# Altium schematic sheet Power_Regulation.SchDoc
size A; SheetNumber: 2; SheetTotal: 11
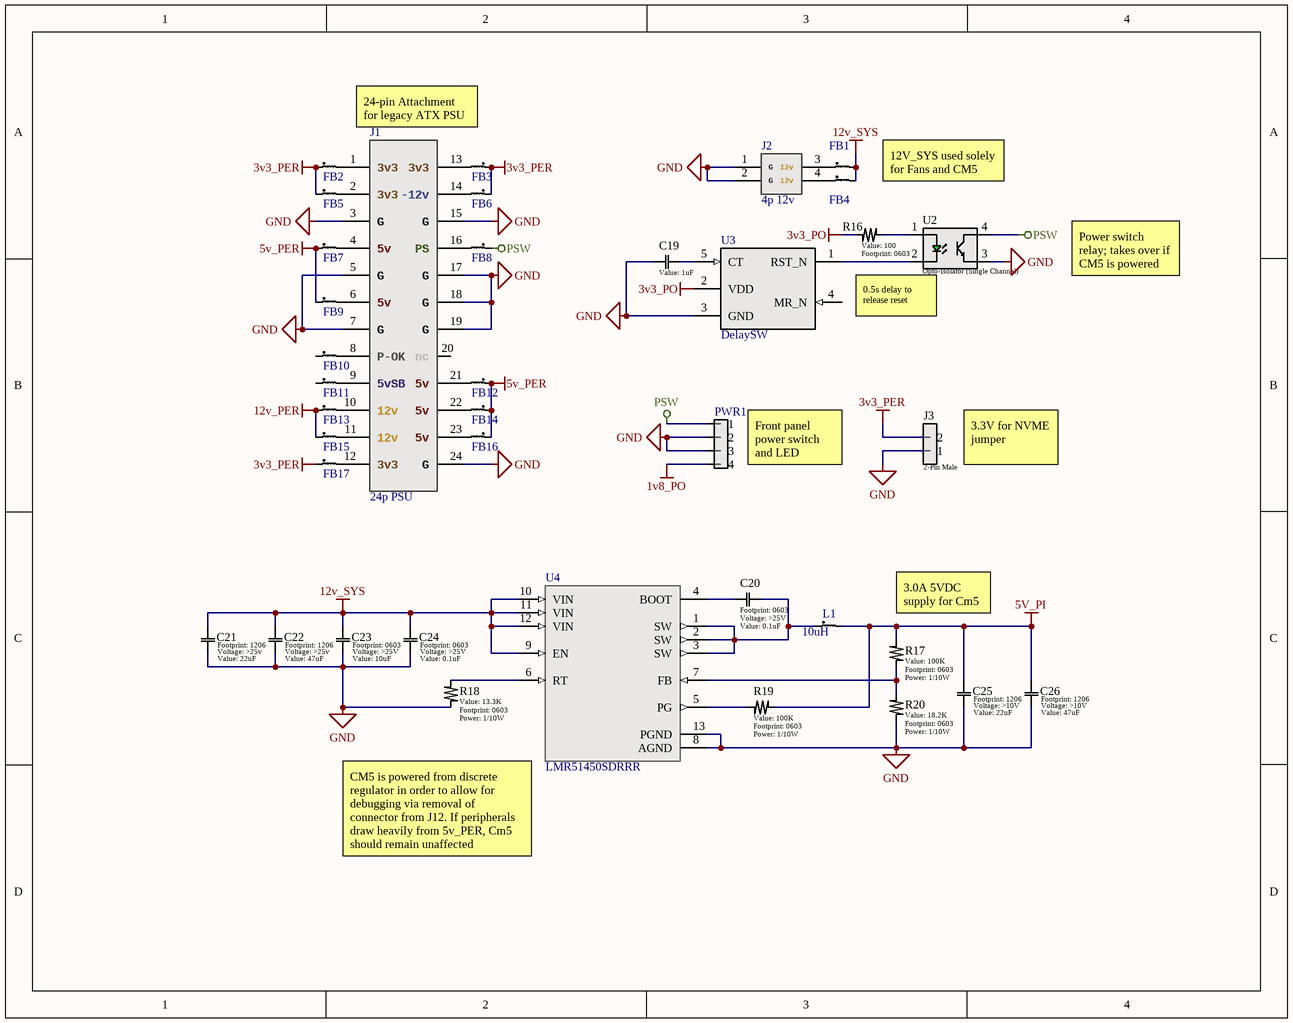
[diagram p0: Power_Regulation.SchDoc]

## Parts
C19  value 1uF  [0603]  (hidden comment: Generic Capacitor)
C20  value 0.1uF  Voltage: >25V  [0603]  (hidden comment: Generic Capacitor)
C21  value 22uF  Voltage: >25v  [1206]  (hidden comment: Generic Capacitor)
C22  value 47uF  Voltage: >25v  [1206]  (hidden comment: Generic Capacitor)
C23  value 10uF  Voltage: >25V  [0603]  (hidden comment: Generic Capacitor)
C24  value 0.1uF  Voltage: >25V  [0603]  (hidden comment: Generic Capacitor)
C25  value 22uF  Voltage: >10V  [1206]  (hidden comment: Generic Capacitor)
C26  value 47uF  Voltage: >10V  [1206]  (hidden comment: Generic Capacitor)
FB1  1206 Ferrite  [1206]  (value not drawn)
FB2  1206 Ferrite  [1206]  (value not drawn)
FB3  1206 Ferrite  [1206]  (value not drawn)
FB4  1206 Ferrite  [1206]  (value not drawn)
FB5  1206 Ferrite  [1206]  (value not drawn)
FB6  1206 Ferrite  [1206]  (value not drawn)
FB7  1206 Ferrite  [1206]  (value not drawn)
FB8  1206 Ferrite  [1206]  (value not drawn)
FB9  1206 Ferrite  [1206]  (value not drawn)
FB10  1206 Ferrite  [1206]  (value not drawn)
FB11  1206 Ferrite  [1206]  (value not drawn)
FB12  1206 Ferrite  [1206]  (value not drawn)
FB13  1206 Ferrite  [1206]  (value not drawn)
FB14  1206 Ferrite  [1206]  (value not drawn)
FB15  1206 Ferrite  [1206]  (value not drawn)
FB16  1206 Ferrite  [1206]  (value not drawn)
FB17  1206 Ferrite  [1206]  (value not drawn)
J1  24p PSU  [CONN_442060007_MOL]
J2  4p 12v  [CON_39281043]
J3  2-Pin Male  [0022057025]
L1  10uH  [SMD 8.2x8.6mm]
PWR1  4-Pin Male Header (0.100" Pitch)  [TSW-104-07-T-S]  (value not drawn)
R16  value 100  [0603]  (hidden comment: Generic Resistor)
R17  value 100K  Power: 1/10W  [0603]  (hidden comment: Generic Resistor)
R18  value 13.3K  Power: 1/10W  [0603]  (hidden comment: Generic Resistor)
R19  value 100K  Power: 1/10W  [0603]  (hidden comment: Generic Resistor)
R20  value 18.2K  Power: 1/10W  [0603]  (hidden comment: Generic Resistor)
U2  Opto-Isolator (Single Channel)  [4-SMD (7.62mm Gull-Wing) Opto-Transistor]
U3  DelaySW  [TSOT-23-5]
U4  LMR51450SDRRR  [WSON-12]

## Nets
1v8_PO: PWR1.4
3v3_PER: FB2.1 FB3.1 FB5.1 FB6.1 FB17.1 J3.2
3v3_PO: R16.1 U3.2(VDD)
5v_PER: FB7.1 FB9.1 FB12.1 FB14.1 FB16.1
5V_PI: C25.1 C26.1 L1.2 R17.2 R19.1
12v_PER: FB13.1 FB15.1
12v_SYS: C21.1 C22.1 C23.1 C24.1 FB1.2 FB4.2 U4.9(EN) U4.10(VIN) U4.11(VIN) U4.12(VIN)
GND: C19.2 C21.2 C22.2 C23.2 C24.2 C25.2 C26.2 J1.3(G) J1.5(G) J1.7(G) J1.15(G) J1.17(G) J1.18(G) J1.19(G) J1.24(G) J2.1(G) J2.2(G) J3.1 PWR1.2 PWR1.3 R18.1 R20.1 U2.3 U3.3(GND) U4.8(AGND) U4.13(PGND)
PSW: FB8.1 PWR1.1 U2.4
NetC19_1: C19.1 U3.5(CT)
NetC20_1: C20.1 U4.4(BOOT)
NetC20_2: C20.2 L1.1 U4.1(SW) U4.2(SW) U4.3(SW)
NetFB1_1: FB1.1 J2.3(12v)
NetFB2_2: FB2.2 J1.1(3v3)
NetFB3_2: FB3.2 J1.13(3v3)
NetFB4_1: FB4.1 J2.4(12v)
NetFB5_2: FB5.2 J1.2(3v3)
NetFB6_2: FB6.2 J1.14(-12v)
NetFB7_2: FB7.2 J1.4(5v)
NetFB8_2: FB8.2 J1.16(PS)
NetFB9_2: FB9.2 J1.6(5v)
NetFB10_2: FB10.2 J1.8(P-OK)
NetFB11_2: FB11.2 J1.9(5vSB)
NetFB12_2: FB12.2 J1.21(5v)
NetFB13_2: FB13.2 J1.10(12v)
NetFB14_2: FB14.2 J1.22(5v)
NetFB15_2: FB15.2 J1.11(12v)
NetFB16_2: FB16.2 J1.23(5v)
NetFB17_2: FB17.2 J1.12(3v3)
NetR16_2: R16.2 U2.1
NetR17_1: R17.1 R20.2 U4.7(FB)
NetR18_2: R18.2 U4.6(RT)
NetR19_2: R19.2 U4.5(PG)
NetU2_2: U2.2 U3.1(RST_N)

Not connected (* = marked no-connect by the designer): FB10 1; FB11 1; J1 20(nc); U3 4(MR_N)

## Notes on the sheet
- 24-pin Attachment for legacy ATX PSU
- 12V_SYS used solely for Fans and CM5
- Power switch relay; takes over if CM5 is powered
- (near U2) 0.5s delay to release reset
- (near PWR1) Front panel power switch and LED
- (near J3) 3.3V for NVME jumper
- (near R17) 3.0A 5VDC supply for Cm5
- (near U4) CM5 is powered from discrete regulator in order to allow for debugging via removal of connector from J12. If peripherals draw heavily from 5v_PER, Cm5 should remain unaffected
- REV
- REVISIONS
- DATE
- DESCRIPTION
- BY
- UNLESS OTHERWISE SPECIFIED, DRAWING DEFINITIONS AND TOLERANCES SHALL BE FOUND UNDER SUPPLIER STANDARDS SS-001. THIS PART AND ALL COMPONENTS OF IT MUST BE RoHS & REACH COMPLIANT. A CERTIFICATE OF COMPLIANCE MUST BE PROVIDED UPON REQUEST.
- ALL INFORMATION ON THIS DOCUMENT IS THE SOLE PROPERTY OF GAMBER-JOHNSON AND SHALL NOT BE COPIED, REPRODUCED, USED OR DISCLOSED IN WHOLE OR IN PART WITHOUT THE WRITTEN CONSENT OF GAMBER-JOHNSON
- TOLERANCES
  .00 ± .060
  .000 ± .020
  .0000 ± .005
  ANGELS ± 1°
- DRAWN BY:
- PROJECT NUMBER:
- SHEET TITLE:
- SHEET
- OF
- DATE:
- LOCATION:
- ASSEMBLY NUMBER
- SIZE
- GAMBER-JOHNSON LLC
  5001 JOERNS DR.
  STEVENS POINT, WI 54481
  +1 (715) 344-5209
- B

## Library data of the parts
C19 = Generic Capacitor: Voltage: 10V; Tolerance: 10%
C20 C23 C24 C26 = Generic Capacitor: Tolerance: 10%
C21 C22 C25 = Generic Capacitor: Tolerance: 20%
FB1-FB17 = HI1206T161R-10: 160 Ohms @ 100MHz 1 Power, Signal Line Ferrite Bead 1206 (3216 Metric) 6A 18mOhm; Manufacturer 1: Laird Steward; DC Resistance (DCR): 18mR; Number of Lines: 1; Impedance: 160R; Supplier 1: Digi-Key; Manufacturer Part Number 1: HI1206T161R-10; RoHS: Yes; Category: Fixed Inductors; Stock 1: 250713; Pricing 1: 1=0.20000, 10=0.15600, 25=0.12920, 50=0.11140, 100=0.10020, 250=0.08464, 500=0.07572, 1000=0.06458 (USD); Mount: Surface Mount; Case/Package: 1206; Weight: 0.0136oz; Case Code (Metric): 3216; Case Code (Imperial): 1206; Core Material: Ferrite; Material: Ferrite; Min Operating Temperature: -40°C; Max Operating Temperature: 125°C; Package Quantity: 1; Packaging: Tape and Reel; Max Current Rating: 6A; Current Rating: 6A; Max DC Current: 6A; Termination: SMD/SMT; Frequency: 100MHz; Test Frequency: 100MHz; Length: 3.2mm; Height: 0.071inch; Width: 0.063inch; Depth: 1.8mm; Lead Free: Lead Free; REACH SVHC: Unknown; ComponentLink1URL: https://datasheet.ciiva.com/22622/1685743-22622771.pdf?src-supplier=Element14; ComponentLink1Description: https://datasheet.ciiva.com/22622/1685743-22622771.pdf?src-supplier=Element14; ComponentLink2URL: https://datasheet.ciiva.com/16714/70065439-16714326.pdf?src-supplier=Allied+Electronics; ComponentLink2Description: https://datasheet.ciiva.com/16714/70065439-16714326.pdf?src-supplier=Allied+Electronics; Supplier Part Number 1: 240-2411-1-ND; LCSC PN: C2926396
J1 = 442060007: Connector Header Through Hole 24 position 0.165" (4.20mm); Mfr_Name: Molex Connector Corporation; RefDes: RefDes; Type: Type; Supplier 1: Mouser; Supplier Part Number 1: 538-44206-0007; LCSC PN: C7541562
J2 = 39281043: Connector Header Through Hole 4 position 0.165" (4.20mm); Mfr_Name: Molex Connector Corporation; RefDes: RefDes; Type: Type; Supplier 1: Avnet; Supplier Part Number 1: 0039281043; LCSC PN: C2845777
J3 = 0022057025: Conn Shrouded Header (4 Sides) HDR 2 POS 2.5mm Solder RA Thru-Hole SPOX™ Bag; Manufacturer 1: Molex; Number of Poles: 2; Voltage Rating: 250V; Contact Resistance: 20mR; Max Voltage Rating (DC): 250.25kV; Max Voltage Rating (AC): 125V; Current Rating: 3A; Insulation Resistance: 1GR; Connector Type: Male Pin; Shrouded: Yes (With); Test Voltage: 1kV; Glow Wire Compliant: Non-compliant; Supplier 1: RSComponents; Manufacturer Part Number 1: 22-05-7025; RoHS: Yes; Category: Headers and Wire Housings; Stock 1: 1440; Pricing 1: 10=0.40100, 250=0.36000, 1000=0.24900, 5000=0.22200, 10000=0.20700 (USD); Mount: Through Hole,Surface Mount; Contact Plating: Tin,Copper; Contact Material: Brass,Bronze; Housing Color: Natural; Housing Material: Nylon; Color: Natural; Material: Nylon,Polyamide; Insulation Material: Nylon; Min Operating Temperature: -40°C; Max Operating Temperature: 105°C; Packaging: Bulk; Gender: Male; Number of Rows: 1; Termination: Solder; Number of Contacts: 2; Orientation: Right Angle; Package Quantity: 1; Voltage Rating (AC): 250V; Number of Positions: 2; Working Voltage: 250V; Voltage Rating (DC): 250V; Number of Circuits: 2; Contact Gender: Male; Series: SPOX™ 5268; Contact Type: Male Pin; Length: 7.65mm; Height: 5.7mm; Pitch: 2.5mm; Depth: 5.1mm; Lead Pitch: 2.5mm; Contact Mating Length: 0.138inch; Radiation Hardening: No; RoHS Compliant: Yes; REACH SVHC: Unknown; Lead Free: Lead Free; Flammability Rating: UL94 V-0; ComponentLink1URL: https://datasheet.ciiva.com/711/022057025-sd-711958.pdf?src-supplier=Digi-Key; ComponentLink1Description: https://datasheet.ciiva.com/711/022057025-sd-711958.pdf?src-supplier=Digi-Key; ComponentLink2URL: https://datasheet.ciiva.com/25265/1766960-25265813.pdf?src-supplier=Newark; ComponentLink2Description: https://datasheet.ciiva.com/25265/1766960-25265813.pdf?src-supplier=Newark; ComponentLink3URL: https://datasheet.ciiva.com/5155/0022057025-pcb-headers-158480-5155683.pdf?src-supplier=Mouser; ComponentLink3Description: https://datasheet.ciiva.com/5155/0022057025-pcb-headers-158480-5155683.pdf?src-supplier=Mouser; ComponentLink4URL: https://datasheet.ciiva.com/19461/2017869-19461071.pdf?src-supplier=Jameco; ComponentLink4Description: https://datasheet.ciiva.com/19461/2017869-19461071.pdf?src-supplier=Jameco; ComponentLink5URL: https://datasheet.ciiva.com/11747/0900766b80da772b-11747276.pdf?src-supplier=RSComponents; ComponentLink5Description: https://datasheet.ciiva.com/11747/0900766b80da772b-11747276.pdf?src-supplier=RSComponents; ComponentLink6URL: https://datasheet.ciiva.com/7920/1877911-7920684.pdf?src-supplier=Element14; ComponentLink6Description: https://datasheet.ciiva.com/7920/1877911-7920684.pdf?src-supplier=Element14; ComponentLink7URL: https://datasheet.ciiva.com/9468/0022057025-pcb-headers-9468379.pdf?src-supplier=Avnet; ComponentLink7Description: https://datasheet.ciiva.com/9468/0022057025-pcb-headers-9468379.pdf?src-supplier=Avnet; Supplier Part Number 1: 6878086; LCSC PN: C918490
L1 = IHLP3232DZER100M5A: 5.1A 10uH ±20% 5.2A - Power Inductor; Mfr_Name: Vishay; Type: DEV; Copyright: Copyright (C) 2023 Ultra Librarian. All rights reserved.; Manufacturer_Part_Number: IHLP3232DZER100M5A; RefDes: RefDes; LCSC PN: C2051768; Supplier 1: Mouser
PWR1 = TSW-104-07-T-S: Connector Header Through Hole 4 position 0.100" (2.54mm); Manufacturer 1: Samtec; Manufacturer Part Number 1: MTSW-104-07-T-S-170; Number of Contacts: 4; Supplier 1: Avnet; RoHS: Yes; Category: Connectors; Mount: Through Hole; Contact Plating: Tin; Contact Material: Bronze; Min Operating Temperature: -55°C; Max Operating Temperature: 105°C; Number of Rows: 1; Termination: Solder; Gender: Male; Packaging: Bulk; Orientation: Vertical; Pitch: 2.54mm; Radiation Hardening: No; RoHS Compliant: Yes; Lead Free: Lead Free; ComponentLink1URL: http://www.samtec.com/documents/webfiles/pdf/HMTSW.PDF?src-supplier=Avnet; ComponentLink1Description: http://www.samtec.com/documents/webfiles/pdf/HMTSW.PDF?src-supplier=Avnet; Supplier Part Number 1: MTSW-104-07-T-S-170
R16 = Generic Resistor: Tolerance: 1%; Power: 1/10W
R17-R20 = Generic Resistor: Tolerance: 1%
U2 = LTV-816S: LTV Series Single Channel 80 V 5000 Vrms Transistor Output Optocoupler SMT-DIP-4; Manufacturer: Vishay Lite-On; Manufacturer Part Number: LTV-816S-TA1; Number of Channels: 1; Forward Voltage: 1.4V; Collector Emitter Voltage (VCEO): 80V; Rise Time: 18000ns; Output Current per Channel: 50mA; Collector Emitter Saturation Voltage: 200mV; Current Transfer Ratio: 320%; Isolation Voltage: 5kV; Input Type: DC; Max Power Dissipation: 200mW; Reverse Breakdown Voltage: 6V; Supplier 1: Digi-Key; RoHS: Yes; Category: Optocouplers; Stock 1: 2; Pricing 1: 1=0.45000, 10=0.27600, 100=0.15870 (USD); Mount: Surface Mount; Case/Package: SMD/SMT; Number of Pins: 4; Min Operating Temperature: -50°C; Max Operating Temperature: 110°C; Max Output Voltage: 80V; Packaging: Tape and Reel; Forward Current: 50mA; Fall Time: 18000ns; Max Input Current: 50mA; Collector-emitter Voltage-Max: 200mV; Series: -; Max Collector Current: 50mA; Number of Elements: 1; Power Dissipation: 200mW; Package Quantity: 1000; Output Voltage: 80V; Number of Circuits: 1; Isolation Voltage-Max: 5kV; Radiation Hardening: No; RoHS Compliant: Yes; Lead Free: Lead Free; ComponentLink1URL: https://datasheet.ciiva.com/15119/getdatasheetpartid-317372-15119066.pdf?src-supplier=Verical; ComponentLink1Description: https://datasheet.ciiva.com/15119/getdatasheetpartid-317372-15119066.pdf?src-supplier=Verical; ComponentLink2URL: https://datasheet.ciiva.com/6573/s-110-ltv-816826846m-s-s-ta-s-ta1-s-tpseries-6573992.pdf?src-supplier=Digi-Key; ComponentLink2Description: https://datasheet.ciiva.com/6573/s-110-ltv-816826846m-s-s-ta-s-ta1-s-tpseries-6573992.pdf?src-supplier=Digi-Key; ComponentLink3URL: https://datasheet.ciiva.com/6573/s-110-ltv-816826846m-s-s-ta-s-ta1-s-tpseries-6573991.pdf?src-supplier=Digi-Key; ComponentLink3Description: https://datasheet.ciiva.com/6573/s-110-ltv-816826846m-s-s-ta-s-ta1-s-tpseries-6573991.pdf?src-supplier=Digi-Key; ComponentLink4URL: https://datasheet.ciiva.com/6573/s-110-ltv-816826846m-s-s-ta-s-ta1-s-tpseries-6573993.pdf?src-supplier=Digi-Key; ComponentLink4Description: https://datasheet.ciiva.com/6573/s-110-ltv-816826846m-s-s-ta-s-ta1-s-tpseries-6573993.pdf?src-supplier=Digi-Key; Supplier Part Number 1: 160-1892-1-ND; LCSC PN: C92647
U3 = TPS3840DL22DBVR: Supervisor Open Drain or Open Collector 1 Channel SOT-23-5 / 2.2V Threshold; Mfr_Name: Texas Instruments; TYPE: TYPE; RefDes: RefDes; LCSC PN: C2867913; Supplier 1: Mouser; Supplier Part Number 1: 595-TPS3840DL22DBVR
U4 = LMR51450SDRRR: 36-V, 5-A synchronous buck converter; MF: Texas Instruments; SnapEDA_Link: https://www.snapeda.com/parts/LMR51450SDRRR/Texas+Instruments/view-part/?ref=snap; Package: WSON-12 Texas Instruments; Value: *; MP: LMR51450SDRRR; Check_prices: https://www.snapeda.com/parts/LMR51450SDRRR/Texas+Instruments/view-part/?ref=eda; LCSC PN: C6890985